# EAGLE schematic precharger (EAGLE 8.3.2)
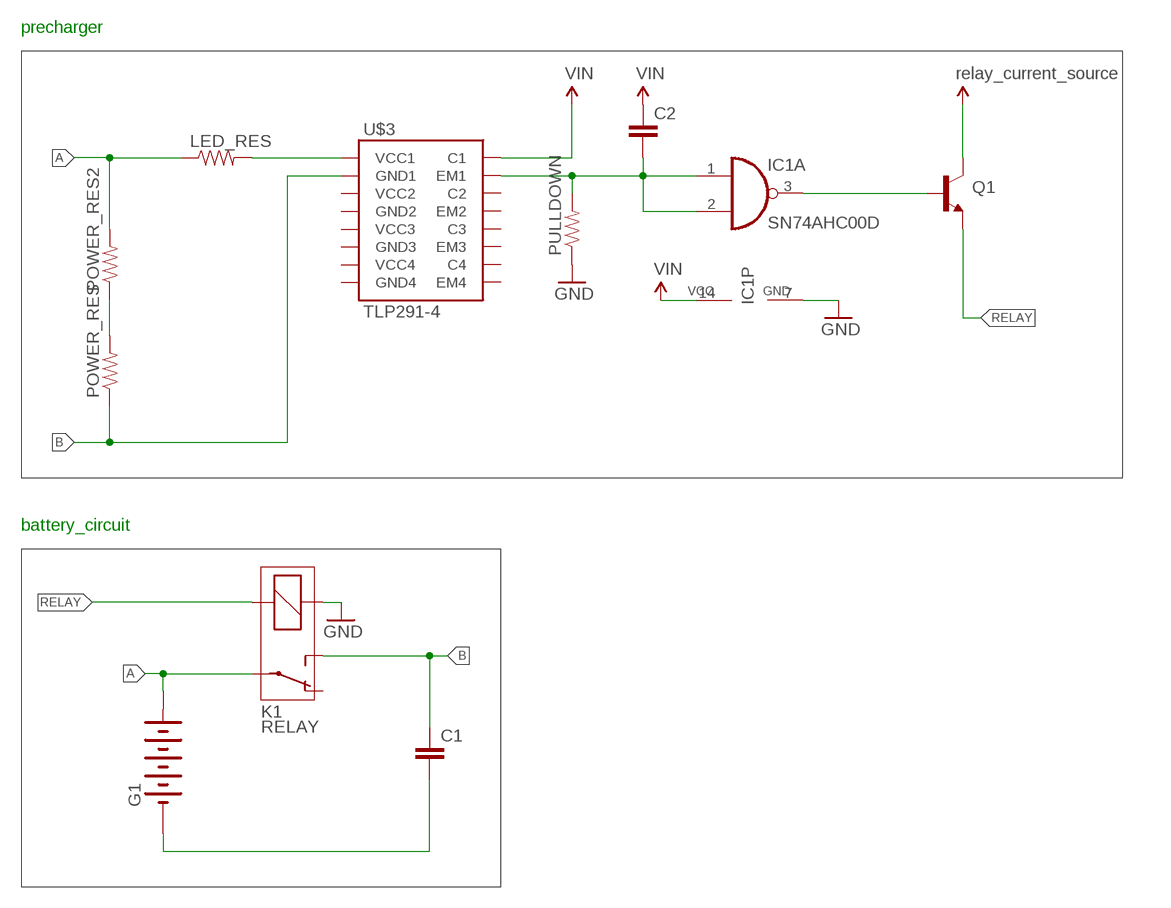
[diagram p0: schematic, sheet 1]

## Parts
C1  CAP0603-CAP  [0603-CAP]
C2  CAP0603-CAP  [0603-CAP]
G1  BATTERY_5_CELL  (no package)
IC1  SN74AHC00D  [SOIC-14]
K1  RELAY  (no package)
LED_RES  RESISTOR0603  [0603-RES]
POWER_RES  RESISTOR10W  [10W_RESISTOR_VISHAY]
POWER_RES2  RESISTOR10W  [10W_RESISTOR_VISHAY]
PULLDOWN  RESISTOR0603  [0603-RES]
Q1  BJT_NPNTIP120  [TO-220]
U$3  TLP291-4  [SOIC-16]

## Nets
12V: Q1.2(COLLECTOR) ; supply symbol labelled relay_current_source
A: G1.+ K1.P LED_RES.1 POWER_RES2.2
B: C1.1 K1.S POWER_RES.1 U$3.2(GND1)
GND: IC1.7(P:GND) K1.1 PULLDOWN.1
N$2: POWER_RES2.1 POWER_RES.2
N$3: C1.2 G1.-
N$4: LED_RES.2 U$3.1(VCC1)
N$6: C2.2 IC1.1(A:I0) IC1.2(A:I1) PULLDOWN.2 U$3.15(EM1)
RELAY: IC1.3(A:O) K1.2 Q1.1(BASE) Q1.3(EMITTER)
VIN: C2.1 IC1.14(P:VCC) U$3.16(C1)
Unconnected: IC1.4(B:I0) IC1.5(B:I1) IC1.6(B:O) IC1.8(C:O) IC1.9(C:I1) IC1.10(C:I0) IC1.11(D:O) IC1.12(D:I1) IC1.13(D:I0) K1.O U$3.3(VCC2) U$3.4(GND2) U$3.5(VCC3) U$3.6(GND3) U$3.7(VCC4) U$3.8(GND4) U$3.9(EM4) U$3.10(C4) U$3.11(EM3) U$3.12(C3) U$3.13(EM2) U$3.14(C2)

## Notes on the sheet
- precharger
- battery_circuit

## Library data of the parts
C1 C2 = HyTechDevices:CAP: Capacitor Standard 0603 ceramic capacitor, and 0.1" leaded capacitor.
G1 = HyTechSymbols:BATTERY_5_CELL: Generic 5-cell battery Source: Sonnenschein
IC1 = HyTechDevices:SN74AHC00: TI SN74AHC00 Quadruple 2-input NAND
K1 = HyTechSymbols:RELAY: RELAY 1 x switch
LED_RES POWER_RES POWER_RES2 PULLDOWN = HyTechDevices:RESISTOR: Resistor Basic schematic elements and footprints for 0603, 1206, and PTH resistors.
Q1 = HyTechDevices:BJT_NPN: Generic NPN BJT MMBT2222A - TRANS-08049 (SOT-23, 1A 40V) MPSA42 - TRANS-09116 (SOT-23, 500mA 300V) MMBT5088LT1G - TRANS-11160 (SOT-23, 50 mA 30V) BC547 - COM-08928 <http://www.sparkfun.com/products/8928> (TO-92 45V 100mA) (1.Collector 2.Base 3.Emitter) 2N3904 - COM-00521 <http://www.sparkfun.com/products/521> (TO-92 40V 200mA) (1.Emitter 2.Base 3.Collector) P2N2222A - COM-12852 <http://www.sparkfun.com/products/12852> (TO-92 40V 600mA) (1.Collector 2.Base 3.Emitter) Source: Sparkfun <https://github.com/sparkfun/SparkFun-Eagle-Libraries>
U$3 = HyTechDevices:TLP291-4: Toshiba Quad Channel Optocoupler TLP291-4